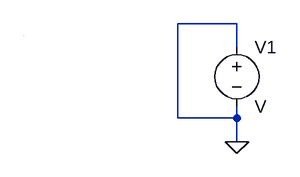
[diagram p0: schematic emptyCircuit.asc]
emptyCircuit.asc, the LTspice schematic file:
Version 4
SHEET 1 880 680
WIRE 288 -16 208 -16
WIRE 288 16 288 -16
WIRE 208 112 208 -16
WIRE 288 112 288 96
WIRE 288 112 208 112
WIRE 288 144 288 112
WIRE 0 0 0 0
FLAG 288 144 0
SYMBOL voltage 288 0 R0
SYMATTR InstName V1

The netlist it stands for:
* emptyCircuit.asc
V1 0 0 V
.backanno
.end